# EasyEDA Pro project OptoGrid_V0.05.epro, board OptoGrid_uLEDArray_V0.05
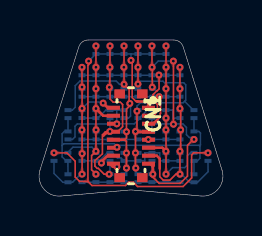
[diagram p5: board, top side]
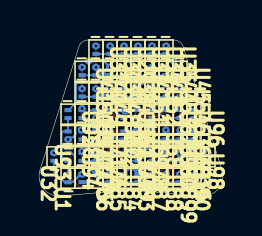
[diagram p6: board, bottom side, seen from below]

Outline 9.1 x 7.81 mm; copper layers: Top Layer, Bottom Layer. Coordinates in mm from the lower left corner of the outline.
Outline path: 0,1.3 1.94,7.46 arc(2.12,7.71) 2.42,7.81 6.68,7.81 arc(6.98,7.71) 7.16,7.46 9.1,1.3 arc(8.93,0.37) 8.06,0 4.55,0.31 1.04,0 arc(0.17,0.37) 0,1.3
Stack: Top Layer 0.035mm / Dielectric1 1.51mm FR4 er 4.5 / Bottom Layer 0.035mm

## Design rules (mm)
template: 用户自定义配置
spacing Default (default): track to track 0.076, other pairs 0 to 0.076
track width Default (default): min 0.076, default 0.127, max 25.4
differential pair differentialPair (default): width min 0.127, default 0.254, max 2.54; gap min 0.152, default 0.152
via Default (default): diameter min 0.351, default 0.351, max 100.025; hole min 0.15, default 0.15, max 59.995

## Placement (name value [footprint] x y rotation side)
CN1  YXT-BB10-16P-02  [CONN-SMD_YXT-BB10-16P-02]  4.55 3.02 270 top
U1  APG0603CGC-TT  [BLUE_LED_KINGBRIGHT_0201]  7.7 0.89 90 bottom
U29  APG0603CGC-TT  [BLUE_LED_KINGBRIGHT_0201]  4.9 7.31 270 bottom
U30  APG0603CGC-TT  [BLUE_LED_KINGBRIGHT_0201]  5.6 7.31 270 bottom
U31  APG0603CGC-TT  [BLUE_LED_KINGBRIGHT_0201]  6.3 7.31 270 bottom
U32  APG0603CGC-TT  [BLUE_LED_KINGBRIGHT_0201]  8.4 1.96 90 bottom
U33  APG0603CGC-TT  [BLUE_LED_KINGBRIGHT_0201]  4.2 7.31 270 bottom
U34  APG0603CGC-TT  [BLUE_LED_KINGBRIGHT_0201]  3.5 7.31 270 bottom
U35  APG0603CGC-TT  [BLUE_LED_KINGBRIGHT_0201]  2.8 7.31 270 bottom
U36  APG0603CGC-TT  [BLUE_LED_KINGBRIGHT_0201]  0.7 1.96 90 bottom
U38  APG0603CGC-TT  [BLUE_LED_KINGBRIGHT_0201]  4.9 6.24 270 bottom
U39  APG0603CGC-TT  [BLUE_LED_KINGBRIGHT_0201]  5.6 6.24 270 bottom
U40  APG0603CGC-TT  [BLUE_LED_KINGBRIGHT_0201]  6.3 6.24 270 bottom
U41  APG0603CGC-TT  [BLUE_LED_KINGBRIGHT_0201]  7 6.24 270 bottom
U42  APG0603CGC-TT  [BLUE_LED_KINGBRIGHT_0201]  4.19 6.24 270 bottom
U43  APG0603CGC-TT  [BLUE_LED_KINGBRIGHT_0201]  3.5 6.24 270 bottom
U44  APG0603CGC-TT  [BLUE_LED_KINGBRIGHT_0201]  2.8 6.24 270 bottom
U45  APG0603CGC-TT  [BLUE_LED_KINGBRIGHT_0201]  2.1 6.24 270 bottom
U47  APG0603CGC-TT  [BLUE_LED_KINGBRIGHT_0201]  4.89 5.17 270 bottom
U48  APG0603CGC-TT  [BLUE_LED_KINGBRIGHT_0201]  5.64 5.17 270 bottom
U49  APG0603CGC-TT  [BLUE_LED_KINGBRIGHT_0201]  6.3 5.17 270 bottom
U50  APG0603CGC-TT  [BLUE_LED_KINGBRIGHT_0201]  7 5.17 270 bottom
U51  APG0603CGC-TT  [BLUE_LED_KINGBRIGHT_0201]  4.2 5.17 270 bottom
U52  APG0603CGC-TT  [BLUE_LED_KINGBRIGHT_0201]  3.5 5.17 270 bottom
U53  APG0603CGC-TT  [BLUE_LED_KINGBRIGHT_0201]  2.8 5.17 270 bottom
U54  APG0603CGC-TT  [BLUE_LED_KINGBRIGHT_0201]  2.1 5.17 270 bottom
U56  APG0603CGC-TT  [BLUE_LED_KINGBRIGHT_0201]  4.9 4.1 270 bottom
U57  APG0603CGC-TT  [BLUE_LED_KINGBRIGHT_0201]  5.6 4.1 90 bottom
U58  APG0603CGC-TT  [BLUE_LED_KINGBRIGHT_0201]  6.3 4.1 90 bottom
U59  APG0603CGC-TT  [BLUE_LED_KINGBRIGHT_0201]  7 4.1 270 bottom
U60  APG0603CGC-TT  [BLUE_LED_KINGBRIGHT_0201]  4.2 4.1 90 bottom
U61  APG0603CGC-TT  [BLUE_LED_KINGBRIGHT_0201]  3.5 4.1 90 bottom
U62  APG0603CGC-TT  [BLUE_LED_KINGBRIGHT_0201]  2.8 4.1 270 bottom
U63  APG0603CGC-TT  [BLUE_LED_KINGBRIGHT_0201]  2.1 4.1 270 bottom
U66  APG0603CGC-TT  [BLUE_LED_KINGBRIGHT_0201]  2.1 3.03 270 bottom
U67  APG0603CGC-TT  [BLUE_LED_KINGBRIGHT_0201]  2.8 3.03 270 bottom
U68  APG0603CGC-TT  [BLUE_LED_KINGBRIGHT_0201]  3.5 3.03 270 bottom
U69  APG0603CGC-TT  [BLUE_LED_KINGBRIGHT_0201]  4.2 3.03 270 bottom
U70  APG0603CGC-TT  [BLUE_LED_KINGBRIGHT_0201]  7 3.03 270 bottom
U71  APG0603CGC-TT  [BLUE_LED_KINGBRIGHT_0201]  6.3 3.03 270 bottom
U72  APG0603CGC-TT  [BLUE_LED_KINGBRIGHT_0201]  5.6 3.03 270 bottom
U73  APG0603CGC-TT  [BLUE_LED_KINGBRIGHT_0201]  4.9 3.03 270 bottom
U74  APG0603CGC-TT  [BLUE_LED_KINGBRIGHT_0201]  4.9 1.96 270 bottom
U75  APG0603CGC-TT  [BLUE_LED_KINGBRIGHT_0201]  5.6 1.96 90 bottom
U76  APG0603CGC-TT  [BLUE_LED_KINGBRIGHT_0201]  6.3 1.96 270 bottom
U77  APG0603CGC-TT  [BLUE_LED_KINGBRIGHT_0201]  7 1.96 270 bottom
U78  APG0603CGC-TT  [BLUE_LED_KINGBRIGHT_0201]  4.2 1.96 270 bottom
U79  APG0603CGC-TT  [BLUE_LED_KINGBRIGHT_0201]  3.5 1.96 90 bottom
U80  APG0603CGC-TT  [BLUE_LED_KINGBRIGHT_0201]  2.8 1.96 270 bottom
U81  APG0603CGC-TT  [BLUE_LED_KINGBRIGHT_0201]  2.1 1.96 270 bottom
U83  APG0603CGC-TT  [BLUE_LED_KINGBRIGHT_0201]  4.9 0.89 270 bottom
U84  APG0603CGC-TT  [BLUE_LED_KINGBRIGHT_0201]  5.6 0.89 270 bottom
U85  APG0603CGC-TT  [BLUE_LED_KINGBRIGHT_0201]  6.3 0.89 270 bottom
U86  APG0603CGC-TT  [BLUE_LED_KINGBRIGHT_0201]  7 0.89 270 bottom
U87  APG0603CGC-TT  [BLUE_LED_KINGBRIGHT_0201]  4.2 0.89 270 bottom
U88  APG0603CGC-TT  [BLUE_LED_KINGBRIGHT_0201]  3.5 0.89 270 bottom
U89  APG0603CGC-TT  [BLUE_LED_KINGBRIGHT_0201]  2.8 0.89 270 bottom
U90  APG0603CGC-TT  [BLUE_LED_KINGBRIGHT_0201]  2.1 0.89 270 bottom
U92  APG0603CGC-TT  [BLUE_LED_KINGBRIGHT_0201]  7.7 4.1 270 bottom
U93  APG0603CGC-TT  [BLUE_LED_KINGBRIGHT_0201]  7.7 3.03 90 bottom
U94  APG0603CGC-TT  [BLUE_LED_KINGBRIGHT_0201]  7.7 1.96 270 bottom
U96  APG0603CGC-TT  [BLUE_LED_KINGBRIGHT_0201]  1.4 4.1 270 bottom
U97  APG0603CGC-TT  [BLUE_LED_KINGBRIGHT_0201]  1.4 3.03 90 bottom
U98  APG0603CGC-TT  [BLUE_LED_KINGBRIGHT_0201]  1.4 1.96 270 bottom
U99  APG0603CGC-TT  [BLUE_LED_KINGBRIGHT_0201]  1.4 0.89 90 bottom

## Footprints (pads in the part's own frame, mm; a bottom-side part is the same pattern mirrored in y, then rotated)
BLUE_LED_KINGBRIGHT_0201
  custom 0.2x0.35 smd: 1(-0.2,0) 2(0.2,0)
CONN-SMD_YXT-BB10-16P-02
  rect 0.2x0.65 smd: 1(-1.4,0.875) 2(-1.4,-0.875) 3(-1,0.875) 4(-1,-0.875) 5(-0.6,0.875) 6(-0.6,-0.875) 7(-0.2,0.875) 8(-0.2,-0.875) 9(0.2,0.875) 10(0.2,-0.875) 11(0.6,0.875) 12(0.6,-0.875) 13(1,0.875) 14(1,-0.875) 15(1.4,0.875) 16(1.4,-0.875)
  rect 0.45x0.53 smd: 17(-2.095,0.565) 18(-2.095,-0.565) 19(2.095,0.565) 20(2.095,-0.565)

## Nets
As in the schematic.

Pads without a net: CN1 17 18 19 20

## Via types
v1: diameter 0.35, hole 0.15, Top Layer to Bottom Layer, 64 vias

## Routing (per net, layer and track width the routed paths; a pad name or vN(x,y) marks a point on that pad's centre or on a via; arc(x,y) is an arc through that point)
X1: length 9.7
  Top Layer w0.076: v1(2.1,1.09) 2.11,1.1 v1(2.11,2.12) 2.11,5.44 2.1,5.45 2.1,6.44
  Top Layer w0.127: v1(3.16,4.65) 3.39,4.42 CN1.2
  Bottom Layer w0.076: v1(2.1,1.09) 2.03,1.09 1.63,0.69 U99.1 1.15,0.68 0.7,1.13 U36.1 ; v1(3.16,4.65) 3.11,4.7 2.44,4.7 v1(2.1,4.38) ; U81.1 2.11,2.16 v1(2.11,2.12) ; U66.1 v1(2.1,3.31) ; 2.1,4.3 2.1,4.38
  vias: v1(2.1,6.44) v1(2.1,5.45)
X2: length 9.4
  Top Layer w0.076: v1(2.8,1.09) 2.58,1.31 2.58,2.02 v1(2.8,2.24) v1(2.8,4.38) v1(2.8,5.37) v1(2.8,6.44) v1(2.8,7.51)
  Top Layer w0.127: CN1.4 3.16,4.02 v1(2.8,4.38)
  Bottom Layer w0.076: 2.8,2.24 2.6,2.45 1.65,2.45 1.42,2.22 ; v1(2.8,2.24) U80.1 ; U67.1 v1(2.8,3.31) ; 2.8,4.3 2.79,4.38
X3: length 12.5
  Top Layer w0.076: v1(3.46,1.09) 3.21,1.09 2.92,1.38 2.86,1.38 2.75,1.5 2.75,1.77 3.12,2.11 3.12,3.07 3.27,3.22 CN1.8 ; v1(3.47,5.44) 3.47,5.43 3.49,5.41 3.5,6.44 3.5,7.51 ; 3.51,5.32 3.51,4.85 3.66,4.69 4.02,4.69 4.13,4.58 4.13,3.46 3.92,3.25
  Top Layer w0.127: 3.5,3.22 3.43,3.15 3.27,3.15 ; 3.27,3.13 3.17,3.02 3.16,3.02
  Bottom Layer w0.076: 3.47,3.61 3.46,3.61 1.86,3.61 1.75,3.49 1.75,2.96 1.62,2.83 U97.1 ; U61.1 v1(3.5,3.23) ; U79.1 3.5,1.13 v1(3.46,1.09)
  vias: v1(3.5,7.51) v1(3.5,6.44)
X4: length 12.9
  Top Layer w0.076: 4.24,2.82 4.32,2.73 v1(4.32,2.15) 4.32,1.4 ; 4.24,2.82 4.33,2.9 v1(4.33,3.22) 4.33,4.35 4.49,4.52 v1(4.49,4.63) 4.46,4.67 4.46,5.33 v1(4.2,5.59) 4.2,7.51 v1(4.2,7.51) ; 4.24,2.82 CN1.10
  Top Layer w0.127: 3.95,2.82 4.23,2.82
  Bottom Layer w0.076: U60.1 4.43,3.9 4.53,4 4.53,4.6 v1(4.49,4.63) ; 1.4,4.3 1.62,4.3 1.76,4.44 1.76,5.52 2,5.75 3.81,5.75 3.98,5.59 v1(4.2,5.59) 4.2,5.37 U51.1 ; v1(4.32,1.4) 4.32,1.22 U87.1
  vias: v1(4.19,6.44)
X5: length 12.6
  Top Layer w0.076: v1(4.85,4.25) 4.85,3.3 v1(4.78,3.23) ; v1(4.9,5.6) v1(4.9,6.44) v1(4.9,7.51) ; 4.77,3.21 v1(4.77,2.16) 4.77,1.41 v1(4.79,1.4)
  Top Layer w0.127: 4.74,3.22 4.75,3.21 5.41,3.21
  Bottom Layer w0.076: v1(4.79,1.4) 4.79,1.2 U83.1 ; 7.23,4.74 7.67,4.3 U92.1 ; 7.23,4.74 7.16,4.67 5.02,4.67 4.85,4.5 v1(4.85,4.25) 4.85,4.25 U56.1 ; 7.23,4.74 7.29,4.79 7.29,5.56 7.19,5.67 6.23,5.67 6.15,5.74 5.04,5.74 v1(4.9,5.6)
X6: length 15.6
  Top Layer w0.076: 5.64,1.12 5.64,1.48 ; v1(5.64,1.09) 5.64,0.95 5.96,0.63 7.01,0.63 7.37,1 7.37,2.53 7.67,2.83 v1(7.7,2.83) ; v1(5.61,5.44) 5.61,6.43 v1(5.6,6.44) ; v1(6.67,3.59) 6.67,6.74 v1(6.67,6.75) ; v1(5.6,7.51) 5.6,6.44
  Top Layer w0.127: 5.64,1.12 5.64,1.47 ; CN1.15 5.51,1.62 5.64,1.48 ; 5.64,1.47 5.69,1.52
  Bottom Layer w0.076: U72.1 5.6,3.59 ; 5.6,3.59 5.62,3.61 7.15,3.61 7.32,3.43 7.32,3.07 7.46,2.93 7.6,2.93 v1(7.7,2.83) ; 5.6,3.59 U57.1 ; U75.1 5.6,1.13 v1(5.64,1.09) ; v1(6.67,6.75) 5.91,6.75 v1(5.6,6.44)
X7: length 9.6
  Top Layer w0.076: v1(6.3,7.51) v1(6.3,6.44) v1(6.3,3.9) v1(6.3,1.09)
  Top Layer w0.127: CN1.11 6.12,2.42 v1(6.3,2.24)
  Bottom Layer w0.076: U71.1 v1(6.3,3.31) ; v1(6.3,1.09) 6.63,1.42 7.24,1.42 7.37,1.55 7.37,2 7.52,2.16 U94.1 ; U76.1 v1(6.3,2.24)
  vias: v1(6.3,5.37)
X8: length 10.7
  Top Layer w0.076: v1(7,6.44) v1(7,5.37) v1(7,4.38) 7.03,4.34 v1(7.03,3.31) 7.03,2.27 v1(7,2.24) v1(7,1.09) 6.8,1.09 6.5,0.8 6.16,0.8 5.99,0.97 5.99,1.37
  Top Layer w0.127: 5.99,1.87 5.84,2.02 CN1.13 ; 5.99,1.86 5.99,1.37
  Bottom Layer w0.076: U77.1 v1(7,2.24) ; U59.1 v1(7,4.38) ; v1(7.03,3.31) 7.03,3.19 ; v1(7,1.09) 7.07,1.09 7.48,0.69 U1.1 7.88,0.69 8.41,1.22 U32.1
Y1: length 23.9
  Top Layer w0.076: v1(0.7,2.16) 1.34,2.16 1.76,1.74 1.76,0.95 1.98,0.73 2.4,0.73 ; 8.4,2.16 7.68,2.16 7.58,2.06 7.58,0.9 7.16,0.48 4.88,0.48 4.67,0.69 4.44,0.69 4.28,0.53 2.6,0.53 2.4,0.73 ; 2.4,0.73 2.4,6.53 2.43,6.57 v1(2.43,6.75) ; v1(4.55,6.79) 4.61,6.79 4.61,4.92 4.78,4.76 4.86,4.76 4.9,4.72
  Top Layer w0.127: 5.41,4.65 5.34,4.73 4.84,4.73 ; 5.42,4.42 5.42,4.64
  Bottom Layer w0.076: U31.2 U30.2 U29.2 4.55,7.11 ; v1(4.55,6.79) 4.55,7.11 ; 4.55,7.11 U33.2 U34.2 2.79,7.11 v1(2.43,6.75)
  vias: v1(8.4,2.16)
Y2: length 7.2
  Top Layer w0.076: 5.81,4.19 5.87,4.25 5.87,4.58 5.65,4.8 5.65,5.06 5.67,5.08 5.67,5.09 5.84,5.26 5.85,5.26 5.95,5.36 5.95,6.05 v1(5.95,6.05)
  Top Layer w0.127: 5.81,4.19 5.67,4.05 ; 5.66,4.04 5.67,4.04
  Bottom Layer w0.076: U45.2 U44.2 U43.2 U42.2 U38.2 U39.2 U40.2 U41.2
Y3: length 6.7
  Top Layer w0.076: v1(5.96,4.97) 6.03,4.9 6.03,4.13 6.01,4.12 6.01,3.96 5.86,3.8
  Top Layer w0.127: CN1.5 5.67,3.62 5.86,3.8
  Bottom Layer w0.076: U50.2 U49.2 v1(5.96,4.97) U47.2 U51.2 U52.2 U53.2 U54.2
Y4: length 6.9
  Bottom Layer w0.076: 3.84,3.63 3.84,4.28 3.85,4.3 ; 3.84,3.63 3.85,3.64 ; 3.84,3.63 v1(3.84,3.61) 4.72,3.61 4.9,3.79 U56.2 4.96,3.9 5.29,4.22 5.29,4.31 5.6,4.3 6.3,4.3 6.64,4.3 6.64,3.9 U59.2 ; 3.5,4.3 3.29,4.3 2.89,3.9 U62.2 U63.2 ; 3.85,4.3 U61.2 ; 3.85,4.3 U60.2
Y5: length 4.9
  Bottom Layer w0.076: U70.2 6.3,2.83 v1(5.42,2.83) 4.9,2.83 3.5,2.83 U66.2
Y6: length 6.6
  Top Layer w0.076: 3.14,1.72 v1(3.07,1.65)
  Top Layer w0.127: 3.34,1.99 3.13,1.77 3.13,1.73
  Bottom Layer w0.076: U77.2 U76.2 5.99,1.76 5.99,2.16 5.6,2.16 5.24,2.16 5.24,1.76 U74.2 U78.2 4.06,1.9 3.87,1.9 3.62,2.16 U79.2 3.49,2.15 3.35,2.15 2.96,1.76 U80.2 U81.2 ; 2.96,1.76 v1(3.07,1.65)
Y7: length 6
  Top Layer w0.127: 3.55,1.55 3.64,1.47 v1(3.85,1.47)
  Bottom Layer w0.076: U90.2 U89.2 U88.2 4.07,0.69 3.85,0.91 v1(3.85,1.47) ; U86.2 U85.2 U84.2 U83.2 U87.2
Y8: length 13.6
  Bottom Layer w0.076: 1.4,1.09 U98.2 ; 7.98,2.51 7.95,2.54 3.95,2.54 v1(3.85,2.44) ; 7.98,2.51 8.02,2.56 8.02,3.15 7.94,3.23 7.71,3.23 ; 7.98,2.51 8,2.49 8,1.89 7.87,1.76 7.71,1.76 ; v1(3.85,2.44) 3.85,2.43 3.86,2.42 ; v1(3.85,2.44) 3.85,2.48 3.72,2.61 1.19,2.61 1.11,2.53 ; U94.2 U1.2 ; U96.2 1.4,3.23 1.22,3.23 1.1,3.12 ; 1.11,2.53 1.11,1.96 1.31,1.76 1.38,1.76 ; 1.11,2.53 1.11,3.12 ; U92.2 7.7,3.23

Small or netless copper shapes (teardrops, artwork), in the pictures only: 113 on Top Layer, 173 on Bottom Layer
